# EAGLE schematic sensors (EAGLE 9.6.2)
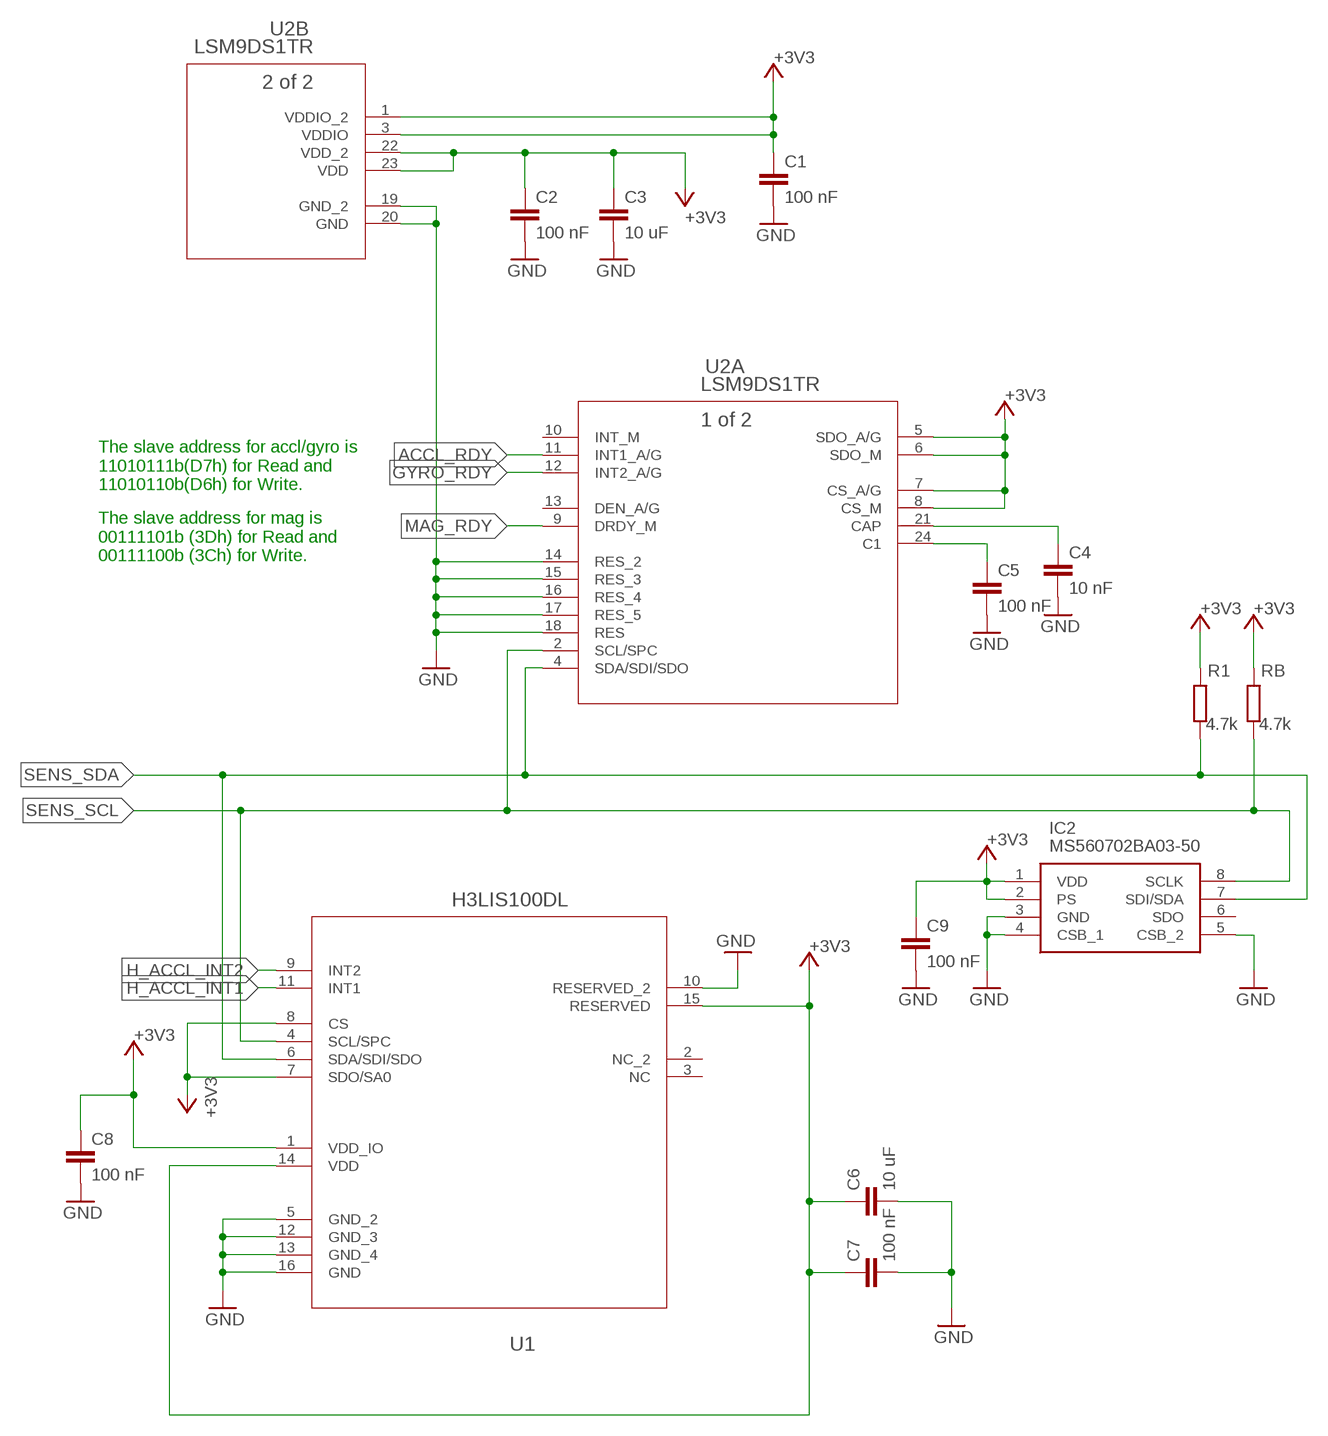
[diagram p0: schematic, sheet 1]

## Parts
C1  100 nF  C-EUC0603  [C0603]
C2  100 nF  C-EUC0603  [C0603]
C3  10 uF  C-EUC0603  [C0603]
C4  10 nF  C-EUC0603  [C0603]
C5  100 nF  C-EUC0603  [C0603]
C6  10 uF  C-EUC0603  [C0603]
C7  100 nF  C-EUC0603  [C0603]
C8  100 nF  C-EUC0603  [C0603]
C9  100 nF  C-EUC0603  [C0603]
IC2  MS560702BA03-50  [MS5607-02BA03]
R1  4.7k  R-EU_R0603  [R0603]
RB  4.7k  R-EU_R0603  [R0603]
U1  H3LIS100DL  [TFLGA16_3P15X3P15_STM]
U2  LSM9DS1TR  [LGA-24_3X3P5X1_STM]

## Nets
+3V3: C1.1 C2.1 C3.1 C6.1 C7.1 C8.1 C9.1 IC2.1(VDD) IC2.2(PS) R1.2 RB.2 U1.1(VDD_IO) U1.7(SDO/SA0) U1.8(CS) U1.14(VDD) U1.15(RESERVED) U2.1(B:VDDIO_2) U2.3(B:VDDIO) U2.5(A:SDO_A/G) U2.6(A:SDO_M) U2.7(A:CS_A/G) U2.8(A:CS_M) U2.22(B:VDD_2) U2.23(B:VDD)
ACCL_RDY: U2.11(A:INT1_A/G)
GND: C1.2 C2.2 C3.2 C4.2 C5.2 C6.2 C7.2 C8.2 C9.2 IC2.3(GND) IC2.4(CSB_1) IC2.5(CSB_2) U1.5(GND_2) U1.10(RESERVED_2) U1.12(GND_3) U1.13(GND_4) U1.16(GND)
GYRO_RDY: U2.12(A:INT2_A/G)
H_ACCL_INT1: U1.11(INT1)
H_ACCL_INT2: U1.9(INT2)
MAG_RDY: U2.9(A:DRDY_M)
N$1: C4.1 U2.21(A:CAP)
N$2: C5.1 U2.24(A:C1)
N$3: U2.14(A:RES_2) U2.15(A:RES_3) U2.16(A:RES_4) U2.17(A:RES_5) U2.18(A:RES) U2.19(B:GND_2) U2.20(B:GND) ; supply symbol labelled GND
SENS_SCL: IC2.8(SCLK) RB.1 U1.4(SCL/SPC) U2.2(A:SCL/SPC)
SENS_SDA: IC2.7(SDI/SDA) R1.1 U1.6(SDA/SDI/SDO) U2.4(A:SDA/SDI/SDO)
Unconnected: IC2.6(SDO) U1.2(NC_2) U1.3(NC) U2.10(A:INT_M) U2.13(A:DEN_A/G)

## Notes on the sheet
- The slave address for accl/gyro is
  11010111b(D7h) for Read and
  11010110b(D6h) for Write.
- The slave address for mag is
  00111101b (3Dh) for Read and
  00111100b (3Ch) for Write.

## Library data of the parts
C1-C9 = rcl:C-EU: CAPACITOR, European symbol; SPICEPREFIX: C
IC2 = MS560702BA03-50:MS560702BA03-50: MS560702BA03-50, Barometric Pressure Sensor, 1200mbar 0 3.6 V Output, 8-Pin QFN Source: Datasheet <http://www.te.com/commerce/DocumentDelivery/DDEController?Action=srchrtrv&DocNm=MS5607-02BA03&DocType=Data Sheet&DocLang=English>; ARROW_PART_NUMBER: MS560702BA03-50; ARROW_PRICE-STOCK: https://www.arrow.com/en/products/ms560702ba03-50/te-connectivity?region=europe; DESCRIPTION: MS560702BA03-50, Barometric Pressure Sensor, 1200mbar 0 3.6 V Output, 8-Pin QFN; HEIGHT: mm; MANUFACTURER_NAME: TE Connectivity; MANUFACTURER_PART_NUMBER: MS560702BA03-50; MOUSER_PART_NUMBER: 824-MS560702BA03-50; MOUSER_PRICE-STOCK: https://www.mouser.co.uk/ProductDetail/Measurement-Specialties/MS560702BA03-50?qs=urSpXqmdEVImCZG1H%252BT8ng%3D%3D
R1 RB = rcl:R-EU_: RESISTOR, European symbol; SPICEPREFIX: R
U1 = H3LIS100DL:H3LIS100DL; COPYRIGHT: Copyright (C) 2022 Ultra Librarian. All rights reserved.; MANUFACTURER_PART_NUMBER: H3LIS100DL; MFR_NAME: STMicroelectronics
U2 = LSM9DS1:LSM9DS1TR; COPYRIGHT: Copyright (C) 2022 Ultra Librarian. All rights reserved.; MANUFACTURER_PART_NUMBER: LSM9DS1TR; MFR_NAME: STMicroelectronics